# EAGLE design open-lux-E-add-VBUS (EAGLE 6.5.0)
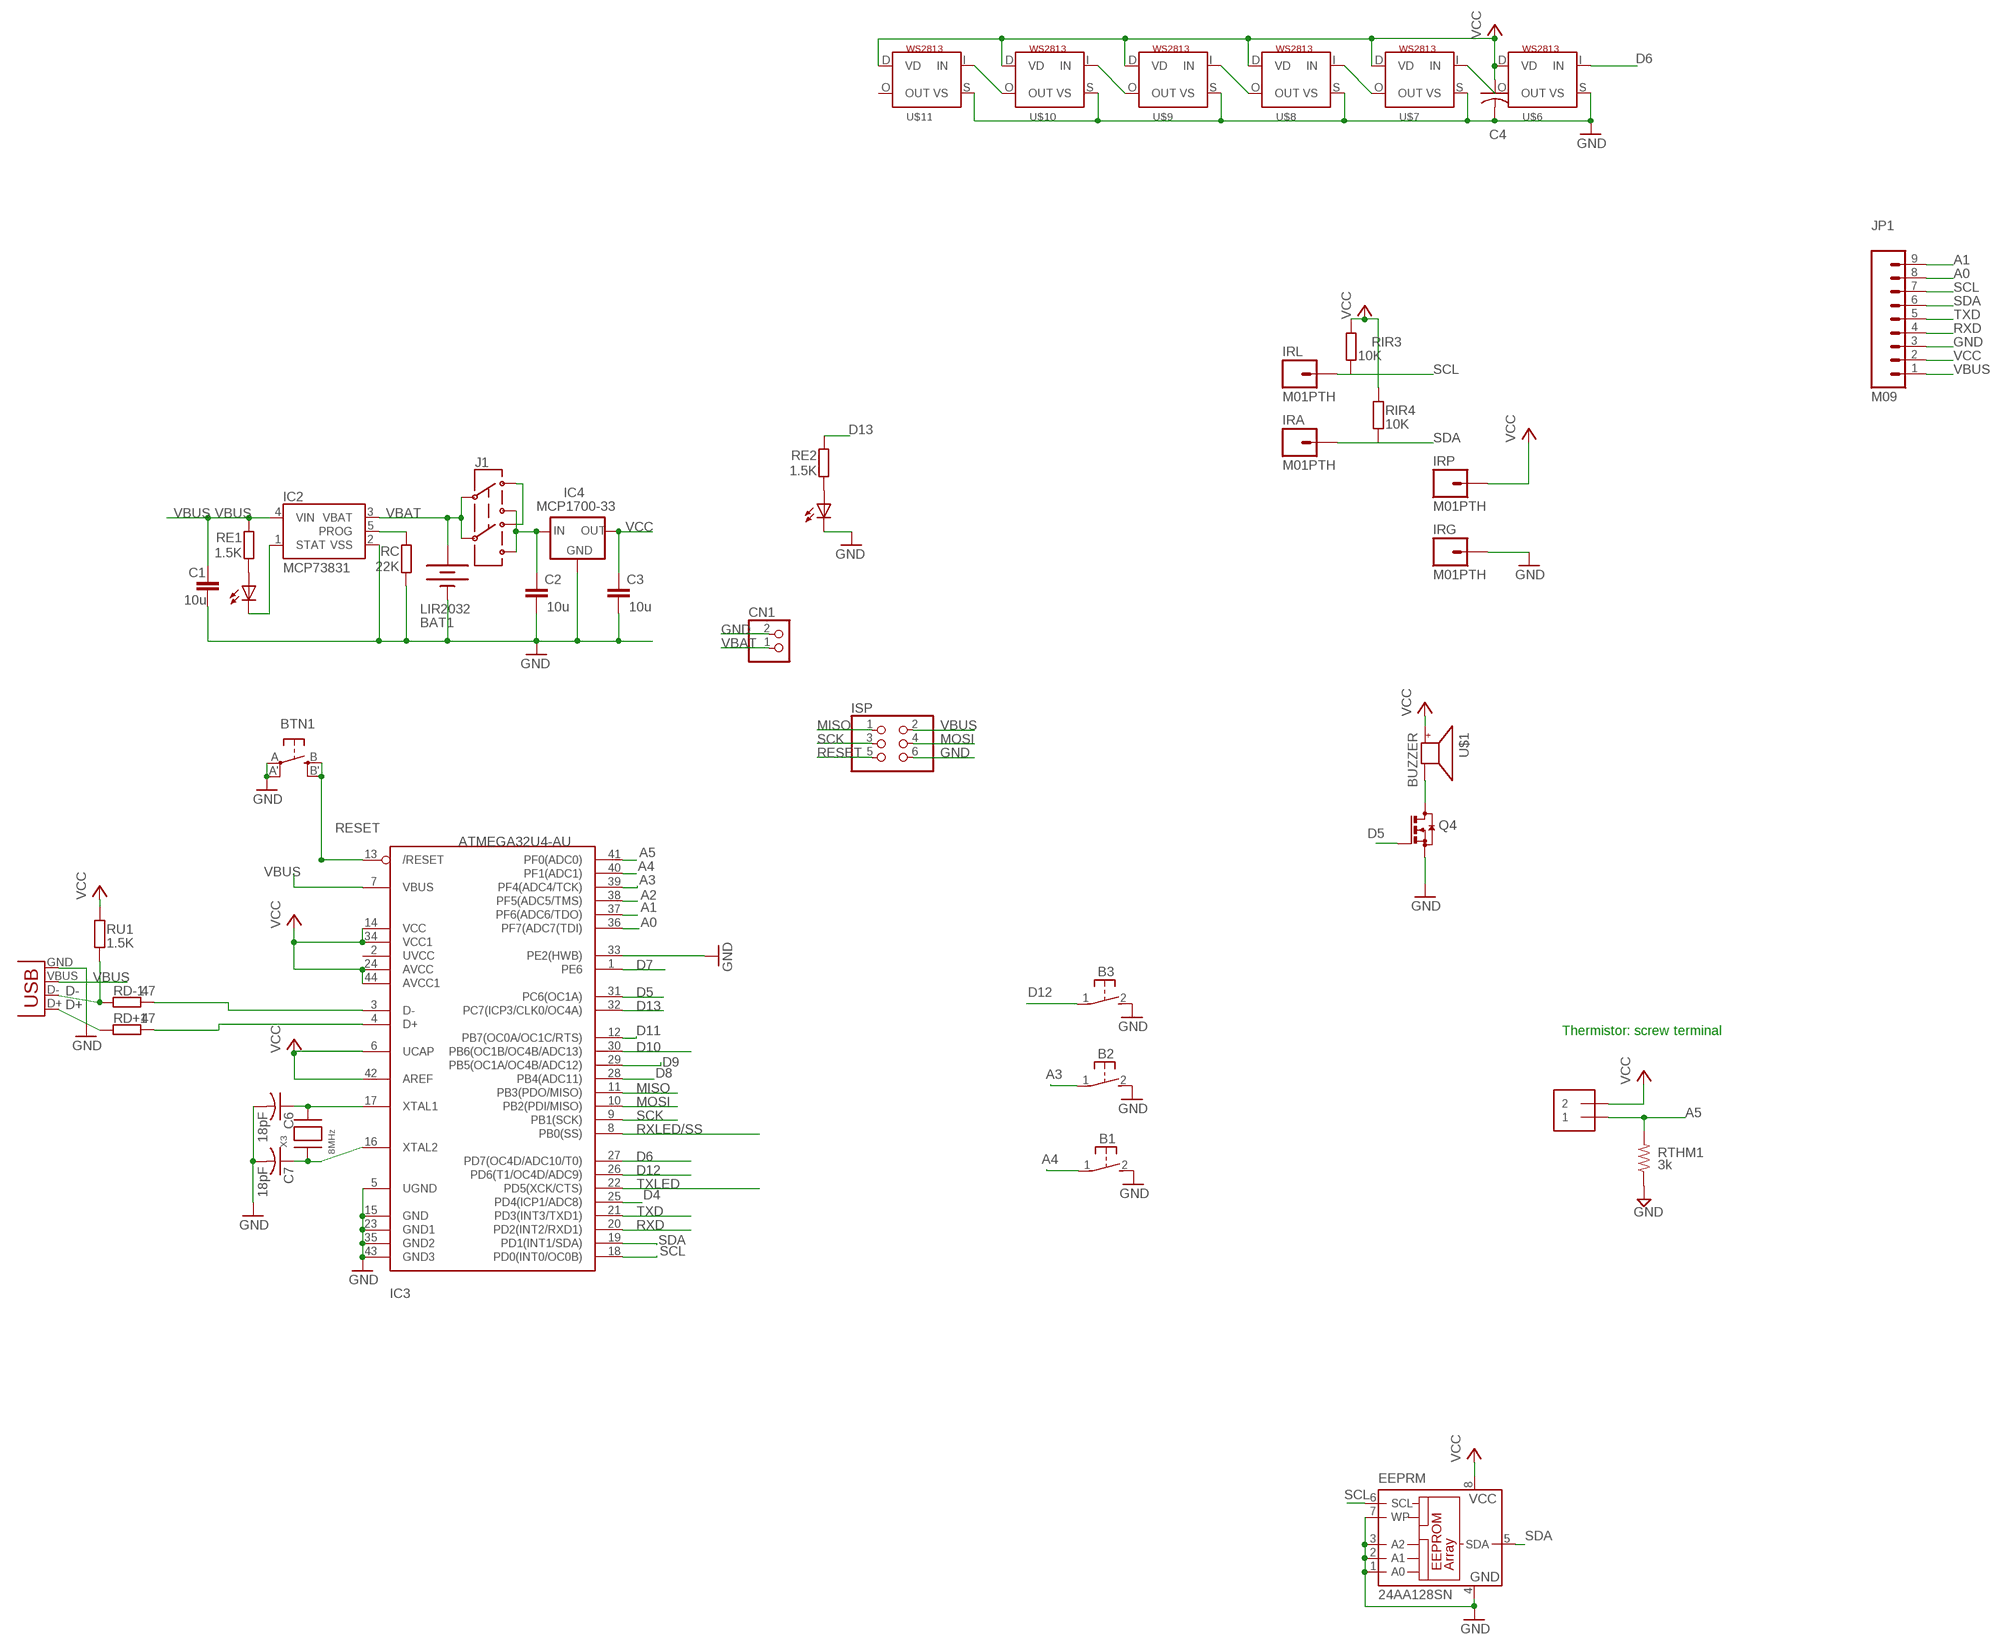
[diagram p0: schematic, sheet 1, part 1 of 2]
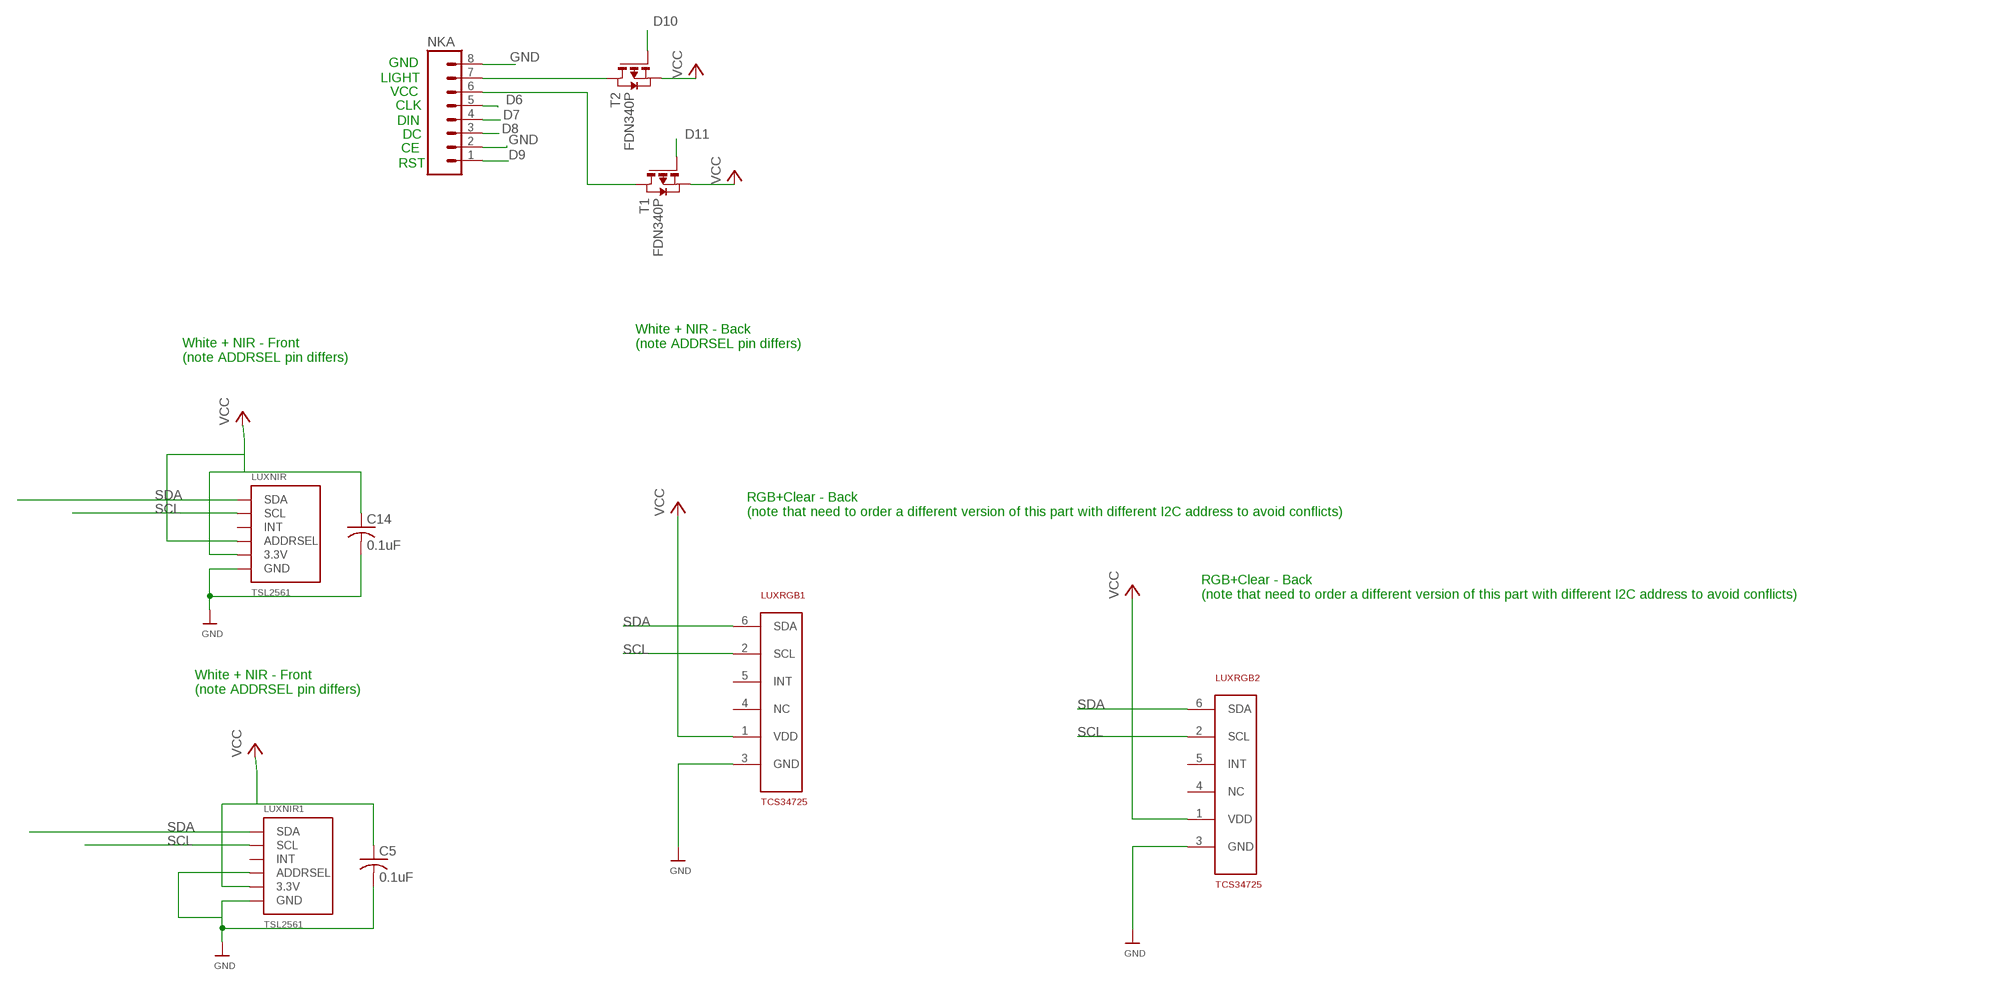
[diagram p1: schematic, sheet 1, part 2 of 2]

## Parts
B1  31-XX  [B3F-31XX]
B2  31-XX  [B3F-31XX]
B3  31-XX  [B3F-31XX]
BAT1  LIR2032  BATTERYBATTCOM_20MM_PTH_SMT  [BATTCOM_20MM_PTH_SMT]
BLNK  0805  LEDCHIPLED_0805  [CHIPLED_0805]
BTN1  EVQQ2  [EVQ-Q2]
C1  10u  C-EUC0805  [C0805]
C2  10u  C-EUC0805  [C0805]
C3  10u  C-EUC0805  [C0805]
C4  C-USC0805K  [C0805K]
C5  0.1uF  C-USC0805  [C0805]
C6  18pF  C-USC0805K  [C0805K]
C7  18pF  C-USC0805K  [C0805K]
C14  0.1uF  C-USC0805  [C0805]
CHARGE  0805  LEDCHIPLED_0805  [CHIPLED_0805]
CN1  JST_2PIN-SMT-RA  [JST-PH-2-SMT-RA]
EEPRM  24AA128SN  [SO-08]
IC2  MCP73831  [SOT23-5]
IC3  ATMEGA32U4-AU  [TQFP44]
IC4  MCP1700-33  MCP1700SOT233  [SOT23]
IRA  M01PTH  [1X01]
IRG  M01PTH  [1X01]
IRL  M01PTH  [1X01]
IRP  M01PTH  [1X01]
ISP  PINHD-2X3  [2X03]
J1  AYZ0202  [AYZ0202]
JP1  M09  [1X09]
LUXNIR  TSL2561  [TSL2561_FN@1]
LUXNIR1  TSL2561  [TSL2561_FN@1]
LUXRGB1  TCS34725  [DFN-6]
LUXRGB2  TCS34725  [DFN-6]
NKA  M08LOCK  [1X08_LOCK]
Q4  BSS123  [SOT23]
RC  22K  R-EU_R0805  [R0805]
RD+1  47  R-EU_R0805  [R0805]
RD-1  47  R-EU_R0805  [R0805]
RE1  1.5K  R-EU_R0805  [R0805]
RE2  1.5K  R-EU_R0805  [R0805]
RIR3  10K  R-EU_R0805  [R0805]
RIR4  10K  R-EU_R0805  [R0805]
RTHM1  3k  R-US_R0805  [R0805@1]
RU1  1.5K  R-EU_R0805  [R0805]
T1  FDN340P  PMOSSOT23  [SOT-23]
T2  FDN340P  PMOSSOT23  [SOT-23]
THM1  1X2-3.5MM  [1X2-3.5MM]
U$1  BUZZER  [SMT-8585-BUZZER]
U$6  WS2813  [RGBLED5050_4]
U$7  WS2813  [RGBLED5050_4]
U$8  WS2813  [RGBLED5050_4]
U$9  WS2813  [RGBLED5050_4]
U$10  WS2813  [RGBLED5050_4]
U$11  WS2813  [RGBLED5050_4]
X2  USBSMD  [USB-MINIB]
X3  8MHz  XTALNX5032  [NX5032]

## Nets
A0: IC3.36(PF7(ADC7(TDI)) JP1.8
A1: IC3.37(PF6(ADC6/TDO)) JP1.9
A2: IC3.38(PF5(ADC5/TMS))
A3: B2.1(P) IC3.39(PF4(ADC4/TCK))
A4: B1.1(P) IC3.40(PF1(ADC1))
A5: IC3.41(PF0(ADC0)) RTHM1.2 THM1.1
D4: IC3.25(PD4(ICP1/ADC8))
D5: IC3.31(PC6(OC1A)) Q4.1(G)
D6: IC3.27(PD7(OC4D/ADC10/T0)) NKA.5 U$6.I(IN)
D7: IC3.1(PE6) NKA.4
D8: IC3.28(PB4(ADC11)) NKA.3
D9: IC3.29(PB5(OC1A/OC4B/ADC12)) NKA.1
D10: IC3.30(PB6(OC1B/OC4B/ADC13)) T2.3(G)
D11: IC3.12(PB7(OC0A/OC1C/RTS)) T1.3(G)
D12: B3.1(P) IC3.26(PD6(T1/OC4D/ADC9))
D13: IC3.32(PC7(ICP3/CLK0/OC4A)) RE2.2
D+: RD+1.1 X2.D+
D-: RD-1.1 RU1.1 X2.D-
GND: B1.2(S) B2.2(S) B3.2(S) BAT1.P$1(-) BLNK.C BTN1.A'(P1) BTN1.A(P) C1.2 C2.2 C3.2 C4.2 C5.2 C6.2 C7.2 C14.2 CN1.2 EEPRM.1(A0) EEPRM.2(A1) EEPRM.3(A2) EEPRM.4(GND) EEPRM.7(WP) IC2.2(VSS) IC3.5(UGND) IC3.15(GND) IC3.23(GND1) IC3.33(PE2(HWB)) IC3.35(GND2) IC3.43(GND3) IC4.1(GND) IRG.1 ISP.6 JP1.3 LUXNIR1.ADR(ADDRSEL) LUXNIR1.VSS(GND) LUXNIR.VSS(GND) LUXRGB1.3(GND) LUXRGB2.3(GND) NKA.2 NKA.8 Q4.2(S) RC.1 RTHM1.1 U$6.S(VS) U$7.S(VS) U$8.S(VS) U$9.S(VS) U$10.S(VS) U$11.S(VS) X2.GND
MISO: IC3.11(PB3(PDO/MISO)) ISP.1
MOSI: IC3.10(PB2(PDI/MISO)) ISP.4
N$1: J1.3 J1.6
N$2: C7.1 IC3.16(XTAL2) X3.P$1
N$3: C6.1 IC3.17(XTAL1) X3.P$2
N$4: NKA.7 T2.1(D)
N$5: CHARGE.C IC2.1(STAT)
N$6: IC2.5(PROG) RC.2
N$7: Q4.3(D) U$1.-
N$8: NKA.6 T1.1(D)
N$10: CHARGE.A RE1.1
N$18: BLNK.A RE2.1
N$21: IC3.4(D+) RD+1.2
N$22: IC3.3(D-) RD-1.2
N$23: U$6.O(OUT) U$7.I(IN)
N$24: U$7.O(OUT) U$8.I(IN)
N$25: U$8.O(OUT) U$9.I(IN)
N$26: U$9.O(OUT) U$10.I(IN)
N$28: U$10.O(OUT) U$11.I(IN)
RESET: BTN1.B'(S1) BTN1.B(S) IC3.13(/RESET) ISP.5
RXD: IC3.20(PD2(INT2/RXD1)) JP1.4
RXLED/SS: IC3.8(PB0(SS))
SCK: IC3.9(PB1(SCK)) ISP.3
SCL: EEPRM.6(SCL) IC3.18(PD0(INT0/OC0B)) IRL.1 JP1.7 LUXNIR1.CLK(SCL) LUXNIR.CLK(SCL) LUXRGB1.2(SCL) LUXRGB2.2(SCL) RIR3.1
SDA: EEPRM.5(SDA) IC3.19(PD1(INT1/SDA)) IRA.1 JP1.6 LUXNIR1.DATA(SDA) LUXNIR.DATA(SDA) LUXRGB1.6(SDA) LUXRGB2.6(SDA) RIR4.1
TXD: IC3.21(PD3(INT3/TXD1)) JP1.5
TXLED: IC3.22(PD5(XCK/CTS))
VBAT: BAT1.P$2(+) CN1.1 IC2.3(VBAT) J1.2 J1.5
VBUS: C1.1 IC2.4(VIN) IC3.7(VBUS) ISP.2 JP1.1 RE1.2 X2.VBUS
VCC: C3.1 C4.1 C5.1 C14.1 EEPRM.8(VCC) IC3.6(UCAP) IC3.14(VCC) IC3.24(AVCC) IC3.34(VCC1) IC3.42(AREF) IC3.44(AVCC1) IC4.2(OUT) IRP.1 JP1.2 LUXNIR1.VDD(3.3V) LUXNIR.ADR(ADDRSEL) LUXNIR.VDD(3.3V) LUXRGB1.1(VDD) LUXRGB2.1(VDD) RIR3.2 RIR4.2 RU1.2 T1.2(S) T2.2(S) THM1.2 U$1.+ U$6.D(VD) U$7.D(VD) U$8.D(VD) U$9.D(VD) U$10.D(VD) U$11.D(VD)
VDD: C2.1 IC4.3(IN) J1.1 J1.4
Unconnected: IC3.2(UVCC) LUXNIR1.INT LUXNIR.INT LUXRGB1.4(NC) LUXRGB1.5(INT) LUXRGB2.4(NC) LUXRGB2.5(INT) U$11.O(OUT)

## Notes on the sheet
- GND
- LIGHT
- VCC
- CLK
- DIN
- DC
- CE
- RST
- White + NIR - Back
  (note ADDRSEL pin differs)
- White + NIR - Front
  (note ADDRSEL pin differs)
- RGB+Clear - Back 
  (note that need to order a different version of this part with different I2C address to avoid conflicts)
- RGB+Clear - Back 
  (note that need to order a different version of this part with different I2C address to avoid conflicts)
- White + NIR - Front
  (note ADDRSEL pin differs)
- Thermistor: screw terminal

## Library data of the parts
B1-B3 = adafruit:31-XX: OMRON SWITCH Now with beefier pads!
BAT1 = SparkFunNew:BATTERY: Battery Holders Various common sizes : AA, AAA, 20mm coin cell and 12mm coin cell.
BLNK CHARGE = led:LED: LED OSRAM: - CHIPLED LG R971, LG N971, LY N971, LG Q971, LY Q971, LO R971, LY R971 LH N974, LH R974 LS Q976, LO Q976, LY Q976 LO Q996 - Hyper CHIPLED LW Q18S LB Q993, LB Q99A, LB R99A - SideLED LS A670, LO A670, LY A670, LG A670, LP A670 LB A673, LV A673, LT A673, LW A673 LH A674 LY A675 LS A676, LA A676, LO A676, LY A676, LW A676 LS A679, LY A679, LG A679 - Hyper Micro SIDELED® LS Y876, LA Y876, LO Y876, LY Y876 LT Y87S - SmartLED LW L88C, LW L88S LB L89C, LB L89S, LG L890 LS L89K, LO L89K, LY L89K LS L896, LA L896, LO L896, LY L896 - TOPLED LS T670, LO T670, LY T670, LG T670, LP T670 LSG T670, LSP T670, LSY T670, LOP T670, LYG T670 LG T671, LOG T671, LSG T671 LB T673, LV T673, LT T673, LW T673 LH T674 LS T676, LA T676, LO T676, LY T676, LB T676, LH T676, LSB T676, LW T676 LB T67C, LV T67C, LT T67C, LS T67K, LO T67K, LY T67K, LW E67C LS E67B, LA E67B, LO E67B, LY E67B, LB E67C, LV E67C, LT E67C LW T67C LS T679, LY T679, LG T679 LS T770, LO T770, LY T770, LG T770, LP T770 LB T773, LV T773, LT T773, LW T773 LH T774 LS E675, LA E675, LY E675, LS T675 LS T776, LA T776, LO T776, LY T776, LB T776 LHGB T686 LT T68C, LB T68C - Hyper Mini TOPLED® LB M676 - Mini TOPLED Santana® LG M470 LS M47K, LO M47K, LY M47K Source: http://www.osram.convergy.de LUXEON: - LUMILED® LXK2-PW12-R00, LXK2-PW12-S00, LXK2-PW14-U00, LXK2-PW14-V00 LXK2-PM12-R00, LXK2-PM12-S00, LXK2-PM14-U00 LXK2-PE12-Q00, LXK2-PE12-R00, LXK2-PE12-S00, LXK2-PE14-T00, LXK2-PE14-U00 LXK2-PB12-K00, LXK2-PB12-L00, LXK2-PB12-M00, LXK2-PB14-N00, LXK2-PB14-P00, LXK2-PB14-Q00 LXK2-PR12-L00, LXK2-PR12-M00, LXK2-PR14-Q00, LXK2-PR14-R00 LXK2-PD12-Q00, LXK2-PD12-R00, LXK2-PD12-S00 LXK2-PH12-R00, LXK2-PH12-S00 LXK2-PL12-P00, LXK2-PL12-Q00, LXK2-PL12-R00 Source: www.luxeon.com KINGBRIGHT: KA-3528ASYC Source: www.kingbright.com
BTN1 = adafruit:EVQQ2: SMT 6mm switch, EVQQ2 series http://www.ladyada.net/library/eagle
C1-C3 = resistor:C-EU: CAPACITOR, European symbol
C4 = adafruit2013:C-US: CAPACITOR, American symbol
C5-C7 C14 = adafruit:C-US: CAPACITOR, American symbol
CN1 = adafruit:JST_2PIN: JST 2-Pin Connectors of various flavors SMT-RA (S2B-PH-SM4) 4UConnector #17311 SMT (B2B-PH-SM4) THM-RA (S2B-PH) THM (B2B-PH)
EEPRM = microchip:24*: Serial EEPROM I2C; MF: MICROCHIP; MPN: 24AA128-I/SN; OC_FARNELL: unknown; OC_NEWARK: 92C6842
IC2 = SparkFunNew:MCP73831: Microchip's MCP73831 Miniature single cell, fully integrated Li-Ion, Li-polymer charge management controller http://ww1.microchip.com/downloads/en/DeviceDoc/21984a.pdf
IC3 = adaprog:ATMEGA32U4
IC4 = adafruit:MCP1700: VOLTAGE REGULATOR
IRA IRG IRL IRP = SparkFun-Connectors:M01: Header 1 Standard 1-pin 0.1" header. Use with straight break away headers (SKU : PRT-00116), right angle break away headers (PRT-00553), swiss pins (PRT-00743), machine pins (PRT-00117), and female headers (PRT-00115).
ISP = pinhead:PINHD-2X3: PIN HEADER
J1 = SparkFunNew:AYZ0202: SPDT Slide Switch Simple SMD single-pull double-throw slide switch. Good for less than 350mA power switch, switching UARTs between devices, etc. Spark Fun Electronics SKU : COM-00597
JP1 = SparkFun-Connectors:M09: Header 9 Standard 9-pin 0.1" header. Use with straight break away headers (SKU : PRT-00116), right angle break away headers (PRT-00553), swiss pins (PRT-00743), machine pins (PRT-00117), and female headers (PRT-00115).
LUXNIR LUXNIR1 = microbuilder:TSL2561: TSL2561 Light-To-Digital Sensor Mouser Part Numbers: CS (obsolete): 856-TSL2561CS DFN (cheapest): 856-TSL2561FN
LUXRGB1 LUXRGB2 = dwbLibrary:TCS34725
NKA = SparkFun-Connectors:M08: Header 8 Standard 8-pin 0.1" header. Use with straight break away headers (SKU : PRT-00116), right angle break away headers (PRT-00553), swiss pins (PRT-00743), machine pins (PRT-00117), and female headers (PRT-00115).
Q4 = transistor-small-signal:BSS123: N-CHANNEL MOS FET
RC RD+1 RD-1 RE1 RE2 RIR3 RIR4 RU1 = rcl:R-EU_: RESISTOR, European symbol
RTHM1 = rcl:R-US_: RESISTOR, American symbol
T1 T2 = zetex:PMOSSOT23: MOS FET
THM1 = adafruit:1X2: 3.5mm Terminal block http://www.ladyada.net/library/pcb/eaglelibrary.html
U$1 = adafruit:BUZZER
U$6-U$11 = adafruit:WS2813
X2 = SparkFun:USB: USB Connectors USB-B-PTH is fully proven SKU : PRT-00139 USB-miniB is fully proven SKU : PRT-00587 USB-A-PCB is untested. USB-A-H is throughly reviewed, but untested. Spark Fun Electronics SKU : PRT-00437 USB-B-SMT is throughly reviewed, but untested. Needs silkscreen touching up. USB-A-S has not been used/tested USB-MB-H has not been used/tested
X3 = adaprog:XTAL

## Net classes
0 default: width 0.254 mm, clearance 0.203 mm
1 power: width 0.254 mm, clearance 0.203 mm

## Board
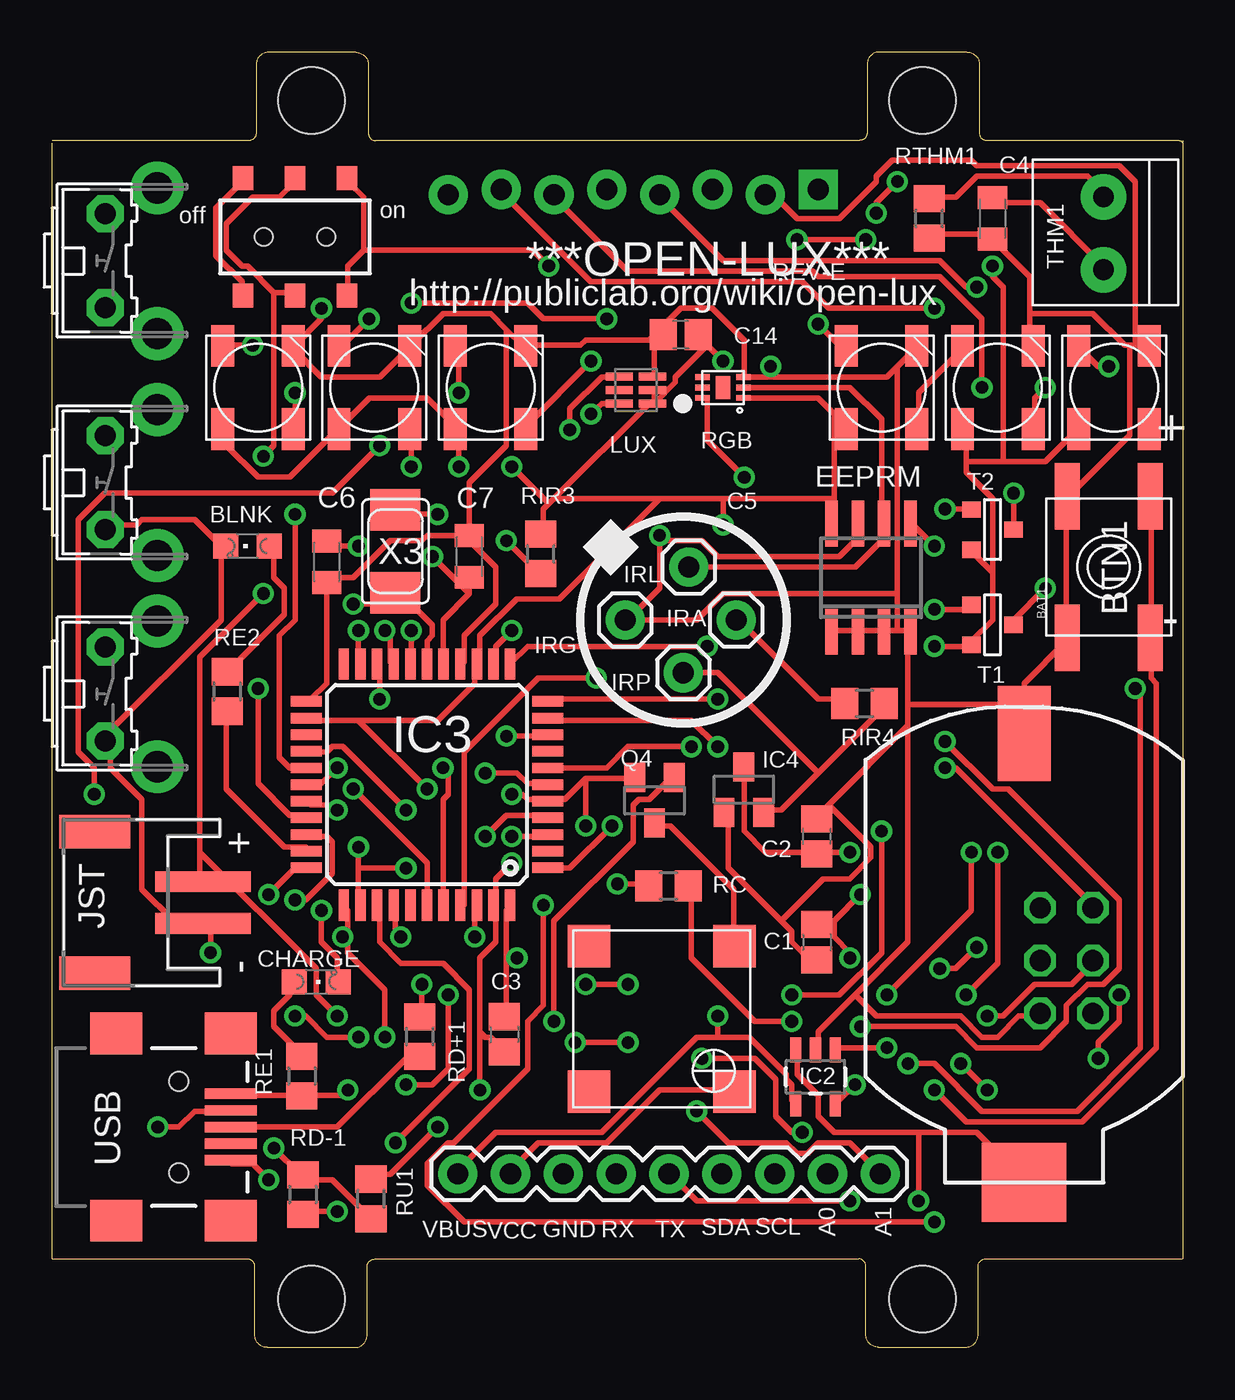
[diagram p2: board, top side]
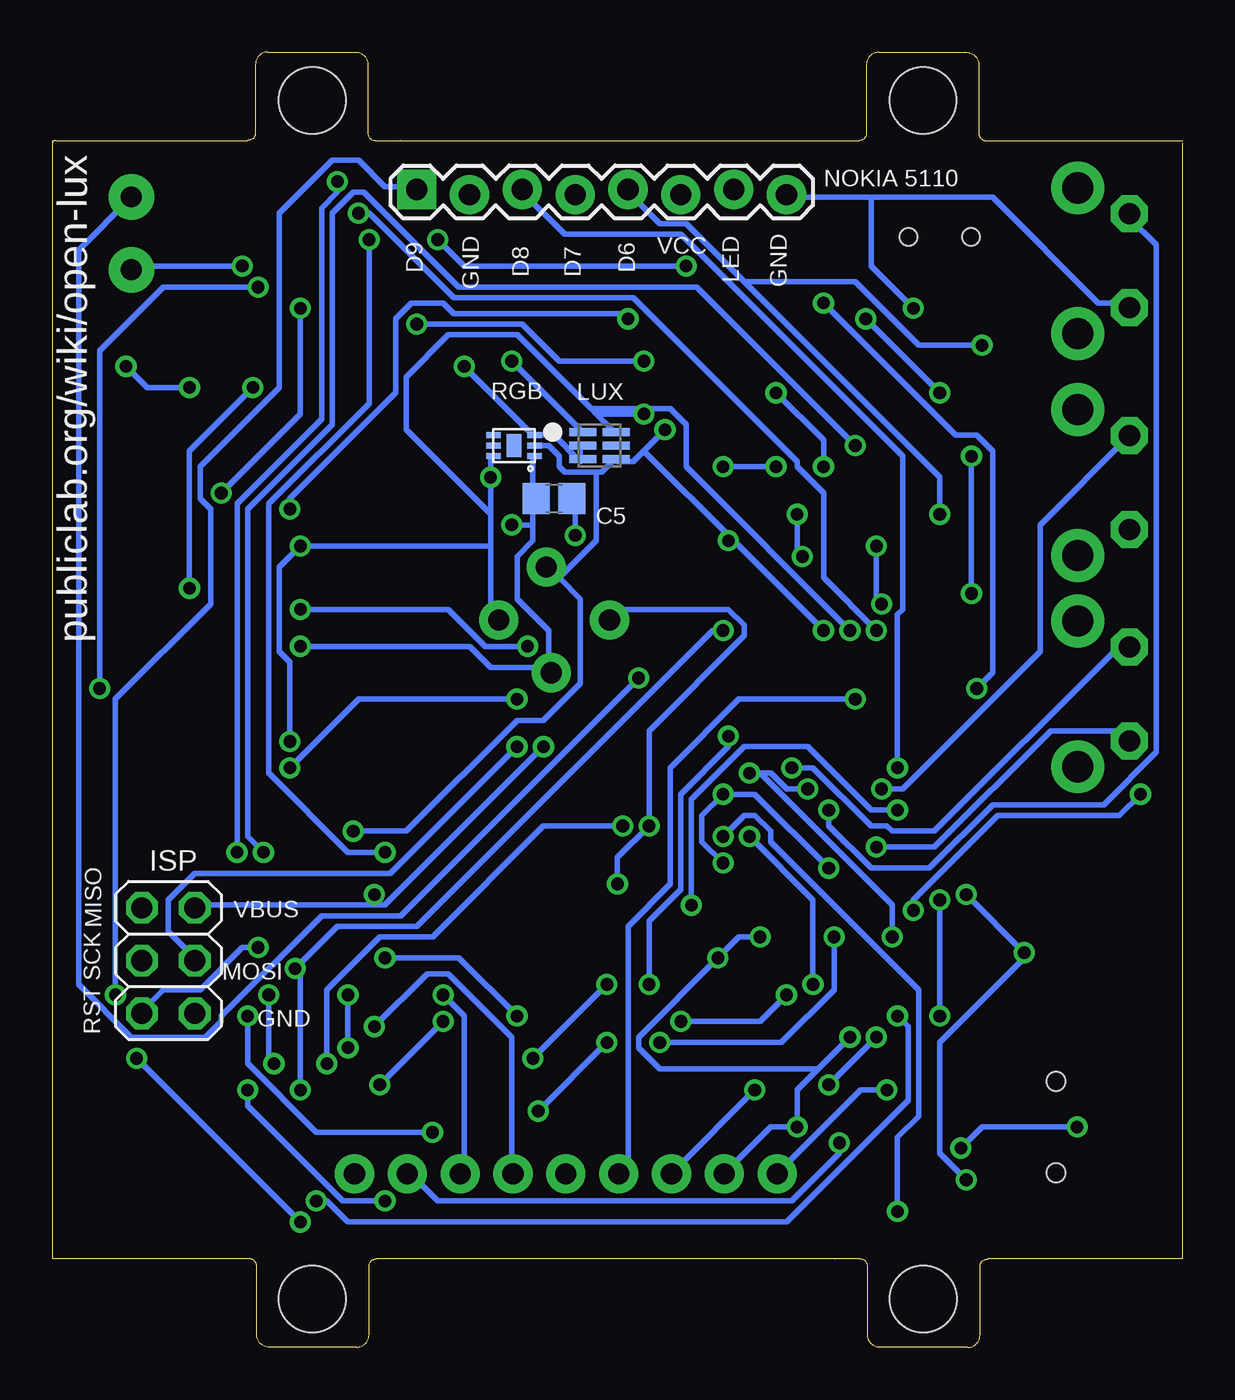
[diagram p3: board, bottom side, seen from below]

Size 54.36 x 62.3 mm. Coordinates in mm from the lower left corner, seen from the top.
Outline: 54.36,57.85 54.36,4.25
Outline: 0,4.25 0,4.27
Outline: 0,4.27 0,57.91
Outline: 38.77,4.26 arc-90 39.12,3.92 39.12,0.61 arc90 39.72,0.01 43.92,0.01 arc90 44.52,0.61 44.52,3.92 arc-90 44.87,4.26 54.33,4.26
Outline: 15.5,4.25 arc90 15.15,3.9 15.15,0.6 arc-90 14.55,0 10.35,0 arc-90 9.75,0.6 9.75,3.9 arc90 9.4,4.25
Outline: 9.39,4.25 arc90 9.37,4.26 0.01,4.26 arc-90 0,4.27
Outline: 15.51,4.26 16.72,4.26
Outline: 16.72,4.26 arc-90 16.73,4.25 16.73,4.25
Outline: 16.72,4.26 38.79,4.26
Outline: 54.36,58.04 54.36,57.87 arc90 54.19,58.04 44.96,58.04 arc-90 44.94,58.05
Outline: 15.56,58.04 arc-90 15.21,58.39 15.21,61.69 arc90 14.61,62.29 10.41,62.29 arc90 9.81,61.69 9.81,58.39 arc-90 9.46,58.04 0,58.04
Outline: 38.83,58.05 arc90 39.18,58.4 39.18,61.7 arc-90 39.78,62.3 43.98,62.3 arc-90 44.58,61.7 44.58,58.4 arc90 44.93,58.05
Outline: 38.82,58.04 37.61,58.04
Outline: 37.61,58.04 arc-90 37.6,58.05 37.6,58.05
Outline: 37.61,58.04 15.54,58.04
Copper layers (1*16): Top 0.035mm / dielectric 1.5mm / Bottom 0.035mm
Design rules "default": minimum track width 10mil, minimum drill 24mil, track to track 8mil, track to pad 8mil, pad to pad 8mil, via to via 8mil, smd to smd 8mil, copper to edge 40mil, drill to drill 8mil, minimum pad ring 10mil, minimum via ring 8mil, stop-mask expansion 4mil, vias tented up to drill 0mil, thermal gap 10mil
Holes 3.2 mm at 41.85,2.34 12.48,2.32 12.48,59.96 41.85,59.98

### Footprints (pad centres in the part's own frame; a part is rotated, then mirrored left to right if it is on the bottom)
B3F-31XX = drill 1.016 pad 1.778 octagon: 1 -2.261,-1.245; 2 2.261,-1.245 | drill 1.499 pad 2.54: 3 -3.505,1.245; 4 3.505,1.245
BATTCOM_20MM_PTH_SMT = smd 4.572 x 2.54: P$1 0,0 | smd 3.81 x 4.064: P$2 21.59,0
CHIPLED_0805 = smd 1.2 x 1.2: A 0,-1.05; C 0,1.05
EVQ-Q2 = smd 3.2 x 1.2: A -3.4,-2; A' 3.4,-2; B -3.4,2; B' 3.4,2
C0805 = smd 1.3 x 1.5: 1 -0.85,0; 2 0.85,0
C0805K = smd 1.1 x 1.4: 1 -1,0; 2 1,0
JST-PH-2-SMT-RA = smd 1 x 4.6: 1 1,-3.7; 2 -1,-3.7 | smd 1.6 x 3.4: NC1 -3.4,1.5; NC2 3.4,1.5
SO-08 = smd 0.6 x 2.2: 1 -1.905,-2.6; 2 -0.635,-2.6; 3 0.635,-2.6; 4 1.905,-2.6; 5 1.905,2.6; 6 0.635,2.6; 7 -0.635,2.6; 8 -1.905,2.6
SOT23-5 = smd 0.55 x 1.2: 1 -0.95,-1.3; 2 0,-1.3; 3 0.95,-1.3; 4 0.95,1.3; 5 -0.95,1.3
TQFP44 = smd 1.5 x 0.5: 1 -5.8,4; 2 -5.8,3.2; 3 -5.8,2.4; 4 -5.8,1.6; 5 -5.8,0.8; 6 -5.8,0; 7 -5.8,-0.8; 8 -5.8,-1.6; 9 -5.8,-2.4; 10 -5.8,-3.2; 11 -5.8,-4; 23 5.8,-4; 24 5.8,-3.2; 25 5.8,-2.4; 26 5.8,-1.6; 27 5.8,-0.8; 28 5.8,0; 29 5.8,0.8; 30 5.8,1.6; 31 5.8,2.4; 32 5.8,3.2; 33 5.8,4 | smd 0.5 x 1.5: 12 -4,-5.8; 13 -3.2,-5.8; 14 -2.4,-5.8; 15 -1.6,-5.8; 16 -0.8,-5.8; 17 0,-5.8; 18 0.8,-5.8; 19 1.6,-5.8; 20 2.4,-5.8; 21 3.2,-5.8; 22 4,-5.8; 34 4,5.8; 35 3.2,5.8; 36 2.4,5.8; 37 1.6,5.8; 38 0.8,5.8; 39 0,5.8; 40 -0.8,5.8; 41 -1.6,5.8; 42 -2.4,5.8; 43 -3.2,5.8; 44 -4,5.8
SOT23 = smd 1 x 1.4: 1 -0.95,-1.1; 2 0.95,-1.1; 3 0,1.1
1X01 = drill 1.016 pad 1.88: 1 0,0
2X03 = drill 1.016 octagon: 1 -2.54,-1.27; 2 -2.54,1.27; 3 0,-1.27; 4 0,1.27; 5 2.54,-1.27; 6 2.54,1.27
AYZ0202 = smd 1 x 1.15: 1 -2.5,2.825; 2 0,2.825; 3 2.5,2.825; 4 -2.5,-2.825; 5 0,-2.825; 6 2.5,-2.825 | hole 0.85: 1.5,0; -1.5,0
1X09 = drill 1.016 pad 1.88: 1 0,0; 2 2.54,0; 3 5.08,0; 4 7.62,0; 5 10.16,0; 6 12.7,0; 7 15.24,0; 8 17.78,0; 9 20.32,0
TSL2561_FN@1 = smd 1.3 x 0.4: ADR -0.8,0; CLK 0.8,-0.65; DATA 0.8,0.65; INT 0.8,0; VDD -0.8,0.65; VSS -0.8,-0.65
DFN-6 = smd 0.28 x 0.7: 1 -0.5,-0.988; 2 0,-0.988; 3 0.5,-0.988; 4 0.5,0.988; 5 0,0.988; 6 -0.5,0.988 | smd 1.1 x 0.7: P$1 0,0
1X08_LOCK = drill 1.016 pad 1.88 square: 1 0,0.127 | drill 1.016 pad 1.88: 2 2.54,-0.127; 3 5.08,0.127; 4 7.62,-0.127; 5 10.16,0.127; 6 12.7,-0.127; 7 15.24,0.127; 8 17.78,-0.127
R0805 = smd 1.3 x 1.5: 1 -0.95,0; 2 0.95,0
R0805@1 = smd 1.3 x 1.5: 1 -0.95,0; 2 0.95,0
SOT-23 = smd 0.787 x 0.889: 1 0.025,-1.016; 2 -0.94,1.016; 3 0.991,1.016
1X2-3.5MM = drill 1 pad 2.184: 1 1.8,0; 2 -1.7,0
SMT-8585-BUZZER = smd 2.05 x 2.05: + -3.5,-3.5; - 3.5,-3.5; NC1 -3.5,3.5; NC2 3.5,3.5
RGBLED5050_4 = smd 2 x 1.1: D -2,1.7; I 2,1.7; O -2,-1.7; S 2,-1.7
USB-MINIB = smd 2.5 x 0.5: D+ 2.5,0; D- 2.5,0.8; GND 2.5,-1.6; ID 2.5,-0.8; VBUS 2.5,1.6 | smd 2.5 x 2: GND@1 -3,-4.5; GND@2 -3,4.5; GND@3 2.5,4.5; GND@4 2.5,-4.5 | hole 0.9: 0,2.2; 0,-2.2
NX5032 = smd 2 x 2.4: P$1 2,0; P$2 -2,0

### Placement (x,y rotation side)
B1  3.81,31.43 270 top
B2  3.81,41.59 270 top
B3  3.81,52.26 270 top
BAT1  46.74,29.53 270 top
BLNK  9.4,38.55 90 top
BTN1  50.8,37.53 270 top
C1  36.77,19.5 270 top
C2  36.77,24.57 90 top
C3  21.74,15.06 270 top
C4  45.21,54.29 270 top
C5  30.23,40.83 0 bottom
C6  13.21,37.78 270 top
C7  20.07,38.04 90 top
C14  30.23,48.71 180 top
CHARGE  12.7,17.59 270 top
CN1  3.56,21.4 90 top
EEPRM  39.37,37.02 0 top
IC2  36.7,13.02 180 top
IC3  18.03,27.07 180 top
IC4  33.26,26.83 0 top
IRA  32.89,34.99 0 top
IRG  27.56,34.99 0 top
IRL  30.61,37.53 0 top
IRP  30.35,32.45 0 top
ISP  48.77,18.61 270 bottom
J1  11.68,53.4 180 top
JP1  19.5,8.36 0 top
LUXNIR  28.07,46.04 180 top
LUXNIR1  28.04,43.37 0 bottom
LUXRGB1  32.26,46.16 90 top
LUXRGB2  32.16,43.37 90 bottom
NKA  36.83,55.56 0 bottom
Q4  28.97,26.32 180 top
RC  29.64,22.2 0 top
RD+1  17.68,14.95 90 top
RD-1  12.06,7.36 270 top
RE1  12.01,13.05 270 top
RE2  8.42,31.55 270 top
RIR3  23.5,38.16 90 top
RIR4  39.06,30.97 0 top
RTHM1  42.16,54.29 90 top
RU1  15.33,7.15 90 top
T1  45.21,34.73 90 top
T2  45.21,39.31 90 top
THM1  50.55,53.53 90 top
U$1  29.31,15.8 90 top
U$6  9.91,46.16 90 top
U$7  15.49,46.16 90 top
U$8  21.08,46.16 90 top
U$9  39.88,46.16 90 top
U$10  45.47,46.16 90 top
U$11  51.05,46.16 90 top
X2  6.1,10.61 0 top
X3  16.51,38.29 90 top

### Tracks (layer width: path | path; a pad name or v marks a point on that pad's centre or on a via)
A0  (via drill 0.61)
  Top 0.254: v16.51,9.84 20.07,13.4 20.07,17.21 18.8,18.48 16.76,18.48 15.75,19.5 15.75,21.02 IC3.36
  Bottom 0.254: v16.51,9.84 16.51,9.34 18.8,7.05 35.81,7.05 37.08,8.32 JP1.8
A1  (via drill 0.61)
  Top 0.254: v16.76,19.75 16.51,20 16.51,21.02 IC3.37 | v27.69,14.67 v25.15,14.67 | v30.99,11.37 32.51,9.84 35.31,9.84 35.81,9.34 36.32,9.34 36.83,9.84 38.35,9.84 39.62,8.57 JP1.9
  Bottom 0.254: v16.76,19.75 16.76,17.21 19.3,14.67 v25.15,14.67 | v30.99,11.37 v27.69,14.67
A3  (via drill 0.61)
  Top 0.254: v14.48,26.86 18.03,23.3 IC3.39
  Bottom 0.254: v14.48,26.86 13.46,26.86 6.86,33.47 6.86,39.56 B2.1
A4  (via drill 0.61)
  Top 0.254: v18.8,27.88 19.05,27.62 19.05,26.61 18.8,26.35 18.8,21.27 IC3.40
  Bottom 0.254: v18.8,27.88 17.78,27.88 14.99,25.08 14.22,25.08 13.97,24.83 11.94,24.83 3.3,33.47 2.79,33.47 B1.1
A5  (via drill 0.61)
  Top 0.254: v26.16,32.2 23.37,32.2 19.81,28.64 19.81,21.27 IC3.41 | RTHM1.2 42.16,55.31 43.43,55.31 44.45,56.33 49.78,56.33 50.55,55.56 THM1.1
  Bottom 0.254: v26.16,32.2 37.59,20.77 41.4,20.77 46.23,15.94 46.23,15.68 46.99,14.92 50.55,14.92 53.09,17.46 53.09,52.77 50.55,55.31 THM1.1
D5  (via drill 0.61)
  Top 0.254: v24.13,15.68 24.13,20.51 27.94,24.32 27.94,26.1 28.19,26.35 28.7,26.35 29.72,27.37 Q4.1 | v19.05,16.95 19.05,13.4 18.29,12.64 v17.02,12.64 | v14.73,14.92 13.21,14.92 12.19,15.94 v11.68,15.94 | v11.68,21.53 12.19,21.53 13.46,22.8 13.46,24.32 13.21,24.57 12.45,24.57 IC3.31
  Bottom 0.254: v24.13,15.68 20.32,15.68 v19.05,16.95 | v14.73,14.92 v17.02,12.64 | v11.68,21.53 v11.68,15.94
D6  (via drill 0.61)
  Top 0.254: v11.68,40.07 11.68,34.99 10.92,34.23 10.92,28.38 11.43,27.88 12.19,27.88 IC3.27 | v9.65,48.2 8.38,48.2 U$6.I
  Bottom 0.254: v11.68,40.07 11.68,41.85 21.08,51.25 | 21.08,51.25 23.88,54.04 25.15,54.04 26.67,55.56 NKA.5 | v9.65,48.2 12.7,48.2 15.75,51.25 21.08,51.25
D7  (via drill 0.61)
  Top 0.254: v26.92,25.08 24.89,23.05 23.88,23.05 IC3.1 | v41.15,13.65 42.42,13.65 44.7,11.37 49.28,11.37 52.32,14.41 52.32,31.43 v52.07,31.69 | v44.45,50.99 43.94,50.99 42.67,52.26 32.26,52.26 29.21,55.31 NKA.4
  Bottom 0.254: v26.92,25.08 30.73,25.08 36.07,19.75 38.61,19.75 41.15,17.21 v41.15,13.65 | v52.07,31.69 52.07,47.94 49.02,50.99 v44.45,50.99
D8  (via drill 0.61)
  Top 0.254: v13.72,27.88 12.95,27.11 12.45,27.11 IC3.28
  Bottom 0.254: v13.72,27.88 13.72,35.24 13.46,35.5 13.46,42.86 24.13,53.53 29.72,53.53 31.75,55.56 NKA.3
D9  (via drill 0.61)
  Top 0.254: v13.72,25.84 13.46,26.1 12.45,26.1 IC3.29 | v23.62,21.27 23.62,16.45 22.86,15.68 22.86,13.4 19.3,9.84 19.05,9.84 18.03,8.83 18.03,7.81 19.81,6.03 v42.42,6.03 | v50.29,13.91 50.29,14.67 51.31,15.68 v51.31,16.95
  Bottom 0.254: v13.72,25.84 14.99,25.84 18.03,28.89 21.08,28.89 23.62,26.35 v23.62,21.27 | v50.29,13.91 v42.42,6.03 | v51.31,16.95 51.31,31.18 46.74,35.75 46.74,40.32 47.24,40.83 47.24,42.36 43.43,46.16 43.43,54.55 40.89,57.09 39.62,57.09 38.35,55.82 36.83,55.82 NKA.1
D10  (via drill 0.61)
  Top 0.254: v42.93,40.32 44.2,40.32 T2.3 | v26.67,49.47 23.62,49.47 22.86,50.23 v17.27,50.23 | v9.91,31.69 9.91,27.11 11.43,25.59 12.19,25.59 IC3.30
  Bottom 0.254: v42.93,40.32 42.93,40.83 37.85,45.91 37.85,49.47 37.08,50.23 35.56,50.23 35.05,49.72 26.92,49.72 v26.67,49.47 | v17.27,50.23 10.92,43.88 9.91,43.88 9.14,43.12 9.14,32.45 v9.91,31.69
D11  (via drill 0.61)
  Top 0.254: v42.42,35.5 44.2,35.5 T1.3 | v31.5,33.72 22.86,33.72 22.1,32.96 IC3.12
  Bottom 0.254: v42.42,35.5 35.31,35.5 33.53,33.72 v31.5,33.72
D12  (via drill 0.61)
  Top 0.254: v17.02,25.84 13.97,28.89 13.46,28.89 13.21,28.64 12.45,28.64 IC3.26
  Bottom 0.254: v17.02,25.84 17.02,25.08 14.99,23.05 12.19,23.05 9.14,26.1 3.81,26.1 1.27,28.64 1.27,53.02 2.54,54.29 B3.1
D13
  Top 0.254: IC3.32 12.19,24.07 11.18,24.07 8.38,26.86 8.38,30.42 RE2.2
D+
  Top 0.254: X2.D+ 13.72,10.61 17.02,13.91 17.53,13.91 RD+1.1
D-  (via drill 0.61)
  Top 0.254: RU1.1 15.24,6.29 13.46,8.06 12.19,8.06 RD-1.1 11.94,8.32 v10.67,9.59 | v5.08,10.61 6.1,10.61 6.86,11.37 8.38,11.37 X2.D-
  Bottom 0.254: v5.08,10.61 9.65,10.61 v10.67,9.59
GND  (via drill 0.61)
  Top 0.254: v10.41,21.78 11.68,23.05 12.19,23.05 IC3.33 | v7.62,18.99 7.62,20 7.37,20.26 CN1.2 7.11,20.51 5.84,20.51 4.32,22.04 4.32,26.35 2.79,27.88 2.79,29.15 B1.2 2.54,29.4 8.13,34.99 8.13,38.55 | v10.41,8.06 9.65,8.83 8.64,8.83 X2.GND | v14.73,24.07 14.73,23.05 | 14.73,23.05 14.73,21.27 IC3.35 | 8.13,38.55 6.86,39.82 4.32,39.82 4.06,39.56 2.79,39.56 B2.2 | 8.13,38.55 BLNK.C | 20.57,15.18 20.83,14.92 21.08,14.92 21.59,14.41 C3.2 | 20.57,15.18 20.57,18.73 21.34,19.5 21.34,21.02 IC3.43 21.34,21.27 21.34,22.54 v22.1,23.3 | 20.57,15.18 v20.57,12.38 | 25.65,27.37 27.94,27.37 Q4.2 | 25.65,27.37 24.64,26.35 23.88,26.35 IC3.5 23.62,26.35 22.86,26.35 22.61,26.61 v22.1,26.61 | v27.18,22.29 28.45,22.29 RC.1 | 25.65,27.37 v25.65,25.08 | 29.21,38.8 29.21,36.51 27.69,34.99 | 29.21,38.8 31.24,38.8 32,38.04 37.85,38.04 38.61,38.8 38.61,39.56 EEPRM.7 | 29.21,38.8 v29.21,39.05 | v17.02,23.05 14.73,23.05 | RTHM1.1 42.16,53.53 45.21,53.53 C4.2 45.21,53.28 46.99,51.5 46.99,49.72 | 46.99,49.72 46.99,48.2 U$10.S | 51.82,48.2 51.56,48.2 50.04,49.72 46.99,49.72 | 51.82,48.2 52.07,48.2 | 52.07,48.2 52.58,48.2 U$11.S | 52.07,48.2 52.07,56.07 51.31,56.83 44.45,56.83 44.2,57.09 40.39,57.09 39.62,56.33 39.62,56.07 37.85,54.29 35.81,54.29 34.8,55.31 34.29,55.31 NKA.2 | 46.74,30.93 46.74,31.94 48.77,33.97 BTN1.A' 48.77,34.23 48.77,40.83 BTN1.A 49.02,41.09 51.82,43.88 51.82,48.2 | 46.74,30.93 BAT1.P$1 46.74,29.65 | 35.05,20.51 35.56,20 35.56,19.5 36.58,18.48 C1.2 | 35.05,20.51 32.51,23.05 32.51,25.59 IC4.1 | EEPRM.1 37.59,34.48 38.61,34.48 EEPRM.2 38.86,34.48 39.88,34.48 EEPRM.3 40.13,34.48 40.64,34.48
  Top 0.254: 38.61,16.95 41.15,19.5 41.15,29.91 | 38.61,16.95 36.83,15.18 36.83,14.41 IC2.2 | 41.15,30.93 41.15,34.23 EEPRM.4 | 41.15,30.93 41.15,29.91 | 41.15,29.91 37.34,26.1 | 37.34,26.1 36.83,25.59 C2.2 | 40.64,34.48 41.15,34.48 EEPRM.4 | 41.4,34.48 EEPRM.4 | 38.61,16.95 39.62,15.94 43.69,15.94 44.7,14.92 45.47,14.92 46.48,15.94 47.5,15.94 ISP.6 | 35.05,20.51 37.08,22.54 38.35,22.54 39.37,23.56 39.37,24.07 37.34,26.1 | 41.15,30.93 46.74,30.93 | 34.54,46.67 40.13,46.67 40.64,47.18 | 34.54,46.67 33.27,46.67 | 40.64,47.18 41.4,47.94 U$9.S | 34.54,46.67 v34.54,47.18 | IC3.23 12.45,31.18 13.21,31.94 C6.2 13.21,37.02 14.48,37.02 16.26,38.8 17.78,38.8 18.03,39.05 20.07,39.05 | IC3.15 19.81,32.96 19.81,34.23 21.34,35.75 21.34,37.53 20.07,38.8 C7.2 20.07,39.05 | 28.96,48.45 28.96,46.67 LUXNIR.VSS | 28.96,48.45 29.21,48.71 C14.2 28.96,48.45 | 28.96,48.45 28.7,48.45 | 28.7,48.45 25.65,48.45 25.4,48.2 22.86,48.2 U$8.S 22.61,48.2 21.84,48.96 | 21.84,48.96 21.08,49.72 18.8,49.72 17.27,48.2 U$7.S 17.02,47.94 15.75,46.67 12.95,46.67 11.68,47.94 U$6.S 11.68,48.2 12.95,49.47 v12.95,49.98 | 20.07,39.05 20.07,41.59 21.84,43.37 21.84,48.96 | 33.27,46.67 33.27,48.45 31.75,49.98 30.23,49.98 28.7,48.45 | 33.27,46.67 LUXRGB1.3 | 40.64,47.18 40.64,36.26 | 40.64,36.26 40.64,34.48 | 27.69,34.99 30.99,34.99 32.26,36.26 40.64,36.26 | 27.69,34.99 IRG.1
  Bottom 0.254: v10.41,21.78 v7.62,18.99 7.62,18.73 11.68,14.67 11.68,9.34 v10.41,8.06 | v14.73,24.07 11.94,24.07 6.35,29.65 3.05,29.65 B1.2 | v20.57,12.38 24.38,8.57 JP1.3 | v27.18,22.29 27.18,23.56 v25.65,25.08 25.65,29.65 21.08,34.23 21.08,34.73 21.84,35.5 26.92,35.5 27.43,34.99 IRG.1 | v29.21,39.05 29.21,40.83 C5.2 | v22.1,23.3 23.11,24.32 23.11,25.59 v22.1,26.61 20.57,26.61 v17.02,23.05 | 14.99,55.31 19.05,55.31 NKA.8 | 14.99,55.31 9.14,55.31 4.06,50.23 2.79,50.23 B3.2 | LUXNIR1.ADR 28.96,43.37 28.96,42.86 LUXNIR1.VSS 28.96,42.61 30.23,43.88 30.99,43.88 LUXRGB2.3 31.24,43.88 v34.54,47.18 | 14.99,55.31 14.99,52.01 v12.95,49.98
MISO  (via drill 0.61)
  Top 0.254: v32,31.18 23.88,31.18 IC3.11 | v42.93,27.88 43.43,27.88 50.04,21.27 ISP.1
  Bottom 0.254: v32,31.18 39.62,31.18 v42.93,27.88
MOSI  (via drill 0.61)
  Top 0.254: v32,28.89 30.73,30.16 23.88,30.16 IC3.10
  Bottom 0.254: v32,28.89 38.1,22.8 47.5,22.8 48.77,21.53 48.77,20 47.5,18.73 ISP.4
N$1
  Top 0.254: J1.3 9.14,50.74 9.14,51.25 7.87,52.52 7.87,54.8 9.14,56.07 J1.6
N$2  (via drill 0.61)
  Top 0.254: 20.07,36.26 C7.1 | 20.07,36.26 18.8,34.99 18.8,32.96 IC3.16 | v18.54,40.07 16.51,40.07 X3.P$1 | 20.07,36.26 v18.29,38.04
  Bottom 0.254: v18.54,40.07 18.54,38.29 v18.29,38.04
N$3  (via drill 0.61)
  Top 0.254: v14.73,38.55 13.21,38.55 C6.1 | v14.48,35.75 16,35.75 16.51,36.26 X3.P$2 16.51,36.51 18.29,34.73 18.29,34.23 18.03,33.97 18.03,32.96 IC3.17
  Bottom 0.254: v14.73,38.55 14.73,36.01 v14.48,35.75
N$4  (via drill 0.61)
  Top 0.254: v46.23,41.09 T2.1 | v42.42,49.98 37.34,49.98 36.07,51.25 25.91,51.25 21.59,55.56 NKA.7
  Bottom 0.254: v46.23,41.09 42.42,44.9 v42.42,49.98
N$5  (via drill 0.61)
  Top 0.254: v12.95,21.02 12.95,19.5 13.72,18.73 13.72,17.72 CHARGE.C | v2.03,26.61 2.03,27.88 1.27,28.64 1.27,39.82 2.54,41.09 13.46,41.09 v15.75,43.37 | v44.2,23.81 44.2,21.02 v40.13,16.95 | v40.13,14.41 37.85,14.41 IC2.1
  Bottom 0.254: v12.95,21.02 12.95,21.53 8.89,25.59 3.05,25.59 v2.03,26.61 | v15.75,43.37 23.37,50.99 34.8,50.99 39.37,55.56 39.88,55.56 40.89,54.55 40.89,44.39 44.96,40.32 44.96,24.57 v44.2,23.81 | v40.13,14.41 v40.13,16.95
N$6  (via drill 0.61)
  Top 0.254: v38.61,12.64 37.85,11.88 IC2.5 | v35.56,15.68 33.78,15.68 30.73,18.73 30.73,22.04 RC.2
  Bottom 0.254: v35.56,15.68 v38.61,12.64
N$7
  Top 0.254: Q4.3 29.21,25.08 29.72,25.08 32.77,22.04 32.77,19.5 U$1.-
N$8  (via drill 0.61)
  Top 0.254: v47.75,36.51 46.23,34.99 T1.1 | v44.7,46.16 44.7,49.47 42.67,51.5 36.83,51.5 36.58,51.75 27.69,51.75 24.13,55.31 NKA.6
  Bottom 0.254: v47.75,36.51 47.75,43.12 v44.7,46.16
N$10
  Top 0.254: CHARGE.A 11.43,17.46 11.43,16.95 10.67,16.19 10.67,15.43 11.94,14.16 RE1.1
N$18
  Top 0.254: BLNK.A 10.67,38.55 10.67,37.02 11.18,36.51 11.18,35.24 8.64,32.7 RE2.1
N$21  (via drill 0.61)
  Top 0.254: v17.78,17.46 17.78,15.94 RD+1.2 | v20.83,24.57 21.84,25.59 23.62,25.59 IC3.4
  Bottom 0.254: v17.78,17.46 17.78,21.53 v20.83,24.57
N$22  (via drill 0.61)
  Top 0.254: v13.72,6.54 12.19,6.54 RD-1.2 | v22.1,24.57 23.62,24.57 IC3.3
  Bottom 0.254: v13.72,6.54 13.72,10.1 12.7,11.11 12.7,17.21 19.81,24.32 19.81,24.83 20.57,25.59 21.08,25.59 v22.1,24.57
N$23  (via drill 0.61)
  Top 0.254: v11.68,45.91 11.68,44.39 U$6.O | v15.24,49.47 13.97,48.2 U$7.I
  Bottom 0.254: v15.24,49.47 v11.68,45.91
N$24  (via drill 0.61)
  Top 0.254: v17.27,42.36 17.27,44.13 U$7.O | v19.56,45.91 19.56,47.94 U$8.I
  Bottom 0.254: v17.27,42.36 17.27,43.62 v19.56,45.91
N$25  (via drill 0.61)
  Top 0.254: v25.91,47.44 22.86,44.39 U$8.O | v36.83,49.21 38.1,47.94 U$9.I
  Bottom 0.254: v25.91,47.44 29.97,47.44 31.75,49.21 v36.83,49.21
N$26
  Top 0.254: U$9.O 41.66,44.39 41.66,45.91 43.69,47.94 U$10.I
N$28  (via drill 0.61)
  Top 0.254: v47.75,46.16 47.24,45.66 47.24,44.39 U$10.O | v50.8,47.18 50.29,47.18 49.53,47.94 U$11.I
  Bottom 0.254: v47.75,46.16 49.78,46.16 v50.8,47.18
RESET  (via drill 0.61)
  Top 0.254: BTN1.B 52.83,40.83 52.83,34.23 BTN1.B' 52.83,33.97 52.83,32.2 53.09,31.94 53.09,14.41 49.53,10.86 43.94,10.86 v42.42,12.38 | v22.1,34.48 21.34,33.72 21.34,32.96 IC3.13 | v42.67,18.23 43.43,18.23 v44.45,19.24
  Bottom 0.254: v22.1,34.48 22.61,34.48 36.83,20.26 40.64,20.26 42.42,18.48 | v44.45,19.24 45.21,19.24 47.24,17.21 49.02,17.21 50.04,16.19 ISP.5 | 42.42,18.48 v42.42,12.38 | 42.42,18.48 v42.67,18.23
RXD  (via drill 0.61)
  Top 0.254: v15.75,31.18 15.75,32.7 IC3.20
  Bottom 0.254: v15.75,31.18 21.34,31.18 24.64,27.88 24.64,22.29 26.67,20.26 26.67,8.83 26.92,8.57 JP1.4
SCK  (via drill 0.61)
  Top 0.254: v21.84,29.4 23.62,29.4 IC3.9 | v27.69,17.46 v25.65,17.46 | v31.24,13.91 33.78,13.91 34.8,12.89 34.8,11.11 35.56,10.35 v36.07,10.35 | v44.96,15.94 45.72,15.94 47.24,17.46 49.02,17.46 50.04,18.48 ISP.3
  Bottom 0.254: v21.84,29.4 21.84,28.89 24.13,26.61 24.13,22.04 25.65,20.51 v25.65,17.46 | v31.24,13.91 v27.69,17.46 | v36.07,10.35 41.66,10.35 44.96,13.65 v44.96,15.94
SCL  (via drill 0.61)
  Top 0.254: v24.89,44.13 24.89,45.15 26.42,46.67 27.18,46.67 LUXNIR.CLK | v17.27,34.48 17.27,32.96 IC3.18 | v21.84,38.8 23.37,37.28 RIR3.1 | LUXRGB1.2 38.35,46.16 39.88,44.64 39.88,39.82 EEPRM.6 39.88,39.56 39.88,38.8 38.61,37.53 IRL.1 | v35.56,16.95 37.85,16.95 39.88,18.99 v39.88,24.83
  Bottom 0.254: LUXRGB2.2 30.48,43.37 29.97,42.86 29.97,42.36 29.72,42.1 28.19,42.1 | 28.19,42.1 27.94,42.1 27.43,42.61 LUXNIR1.CLK 27.18,42.61 26.42,42.61 25.91,43.12 | 25.91,43.12 v24.89,44.13 | 25.91,43.12 21.59,38.8 | 21.59,38.8 v17.27,34.48 | 21.59,38.8 v21.84,38.8 | v35.56,16.95 34.54,15.94 34.54,8.57 JP1.7 | v39.88,24.83 37.34,24.83 32,30.16 30.73,30.16 28.96,31.94 28.96,36.01 29.97,37.02 | 29.97,37.02 30.48,37.53 IRL.1 29.97,37.02 | 28.19,42.1 28.19,38.8 29.97,37.02
SDA  (via drill 0.61)
  Top 0.254: v33.27,41.85 31.5,43.62 31.5,45.66 LUXRGB1.6 | v25.91,44.9 26.42,45.4 27.18,45.4 LUXNIR.DATA | RIR4.1 38.1,31.18 36.83,31.18 33.02,34.99 IRA.1 | v16,34.48 16.26,34.23 16.26,32.96 IC3.19 | v42.42,38.55 41.4,39.56 EEPRM.5 | v38.86,15.43 43.43,15.43 44.45,14.41 47.5,14.41 48.77,15.68 48.77,16.45 49.78,17.46 50.55,17.46 51.31,18.23 51.31,21.53 45.97,26.86 45.21,26.86 v42.93,29.15
  Bottom 0.254: 33.27,38.55 33.27,35.24 33.02,34.99 IRA.1 | 33.27,38.55 33.27,40.07 | 33.27,40.07 v33.27,41.85 33.27,42.86 LUXRGB2.6 | 28.45,45.15 32,48.71 35.31,48.71 37.34,46.67 37.34,44.13 33.27,40.07 | 28.45,45.15 28.19,44.9 | 28.19,44.9 27.43,44.13 LUXNIR1.DATA | 28.19,44.9 v25.91,44.9 | v16,34.48 23.88,42.36 23.88,44.39 24.64,45.15 28.45,45.15 | 33.27,38.55 v42.42,38.55 43.43,37.53 43.43,33.47 42.93,32.96 v42.93,29.15 | v38.86,15.43 36.32,17.97 35.31,17.97 32.26,14.92 32.26,8.57 JP1.6
TXD  (via drill 0.61)
  Top 0.254: v14.73,34.48 14.73,32.96 IC3.21 | v39.62,54.55 39.62,55.05 v40.64,56.07 | v45.47,23.81 45.47,18.48 v43.94,16.95 | v44.96,12.38 v43.69,13.65 | v38.35,7.05 30.99,7.05 29.72,8.32 JP1.5
  Bottom 0.254: v14.73,34.48 17.27,37.02 17.27,41.09 18.54,42.36 18.54,42.61 26.42,50.48 35.05,50.48 39.12,54.55 v39.62,54.55 | v40.64,56.07 40.64,55.56 41.4,54.8 41.4,44.64 45.47,40.58 v45.47,23.81 | v43.94,16.95 43.94,13.91 v43.69,13.65 | v44.96,12.38 44.96,11.62 40.39,7.05 v38.35,7.05
VBAT  (via drill 0.61)
  Top 0.254: 41.66,10.35 44.45,10.35 46.74,8.06 BAT1.P$2 | 41.66,10.35 37.59,10.35 36.83,11.11 36.83,12.13 35.81,13.14 35.81,14.16 IC2.3 | 10.67,50.74 11.68,50.74 J1.2 | 10.67,50.74 9.4,52.01 9.14,52.01 8.38,52.77 8.38,54.04 9.65,55.31 10.92,55.31 11.68,56.07 J1.5 | 10.67,50.74 10.67,43.37 v10.16,42.86 | v10.16,36.26 7.11,33.21 7.11,23.81 | 7.11,23.81 7.11,22.54 CN1.1 | v41.66,7.05 41.66,10.35 | v13.72,15.94 12.7,16.95 12.7,18.23 7.11,23.81
  Bottom 0.254: v10.16,36.26 v10.16,42.86 | v41.66,7.05 41.15,7.05 40.13,6.03 19.05,6.03 13.21,11.88 13.21,15.43 v13.72,15.94
VBUS  (via drill 0.61)
  Top 0.254: v30.73,28.89 27.69,28.89 26.67,27.88 23.88,27.88 IC3.7 | 37.59,20.51 36.83,20.51 C1.1 | v38.86,21.78 37.59,20.51 | X2.VBUS 8.64,12.13 11.94,12.13 RE1.2 12.19,12.13 13.97,12.13 v14.22,12.38 | 32,14.92 30.99,14.92 26.42,10.35 21.34,10.35 19.56,8.57 JP1.1 | 32,14.92 33.53,14.92 35.31,13.14 35.31,12.89 35.56,12.64 35.56,11.88 IC2.4 | 37.59,20.51 37.59,19.75 38.35,18.99 v38.35,18.73 | 32,14.92 v32,15.94
  Bottom 0.254: v30.73,28.89 38.35,21.27 38.86,21.27 | 38.86,21.27 47.5,21.27 ISP.2 | 38.86,21.27 v38.86,21.78 | v14.22,12.38 15.49,12.38 19.3,8.57 JP1.1 | v38.35,18.73 34.8,18.73 v32,15.94
VCC  (via drill 0.61)
  Top 0.254: 21.84,18.73 21.84,21.02 IC3.44 | 21.84,18.73 21.84,15.94 C3.1 | v18.54,10.61 16.26,8.32 15.49,8.32 RU1.2 | 14.22,19.75 14.22,18.99 16,17.21 v16,14.92 | 14.22,19.75 14.22,21.02 IC3.34 | v20.32,19.75 20.32,21.02 IC3.42 | U$1.+ 32.77,12.38 29.21,12.38 26.67,9.84 23.37,9.84 22.1,8.57 JP1.2 | v22.35,18.73 21.84,18.73 | C4.1 45.21,55.05 47.5,55.05 50.55,52.01 THM1.2 | 45.21,37.28 45.21,34.99 44.2,33.97 T1.2 44.2,33.72 v42.42,33.72 | 45.21,37.28 44.2,38.29 T2.2 | 43.94,42.61 43.94,42.1 45.21,40.83 45.21,37.28 | 43.94,42.61 43.94,44.13 U$10.D | 43.94,42.61 45.72,42.61 | 45.72,42.61 47.75,42.61 49.28,44.13 U$11.D | v45.21,52.01 45.21,51.5 45.72,50.99 45.72,42.61 | 36.83,27.62 40.13,30.93 RIR4.2 | 36.83,27.62 35.05,25.84 34.29,25.84 IC4.2 | 36.83,27.62 32,32.45 IRP.1 | 14.73,30.16 18.54,30.16 20.32,31.94 20.32,32.7 IC3.14 20.57,32.96 20.57,34.23 22.35,36.01 24.38,36.01 29.21,40.83 | 14.73,30.16 12.45,30.16 IC3.24 | v20.83,27.62 22.35,27.62 22.86,27.11 23.62,27.11 IC3.6 | 14.73,30.16 v18.03,26.86 | U$6.D 8.38,44.13 8.38,43.37 9.91,41.85 11.43,41.85 13.72,44.13 U$7.D 13.97,44.39 15.24,45.66 18.03,45.66 19.3,44.39 U$8.D 19.56,44.13 v19.56,42.36 | 37.59,44.9 38.1,44.39 U$9.D | 37.59,44.9 36.83,45.66 33.27,45.66 LUXRGB1.1 | 37.59,44.9 37.59,40.83 | 37.59,40.83 37.59,39.82 EEPRM.8 | 31.5,48.2 30.99,48.71 C14.1 31.5,48.2 | 31.5,48.2 v32.26,47.44 | 28.96,45.4 28.96,45.91 LUXNIR.ADR | 24.13,40.83 28.7,45.4 LUXNIR.VDD 28.96,45.4 | 24.13,40.83 23.88,40.58 | 23.88,40.58 23.62,40.32 23.62,39.31 RIR3.2 | 31.5,48.2 29.97,46.67 29.97,46.42 28.96,45.4 | 24.13,40.83 29.21,40.83 | 29.21,40.83 32.26,40.83 | 32.26,40.83 37.59,40.83
  Top 0.254: 23.88,40.58 v22.1,42.36 | 32.26,40.83 v32.26,39.56 | v13.97,19.75 14.22,19.75
  Bottom 0.254: JP1.2 21.84,8.57 19.81,10.61 v18.54,10.61 18.54,12.38 17.53,13.4 | 17.53,13.4 v16,14.92 | v20.32,19.75 21.34,19.75 v22.35,18.73 26.16,14.92 26.16,14.41 25.15,13.4 17.53,13.4 | v45.21,52.01 50.55,52.01 THM1.2 | 31.24,40.83 31.24,42.86 LUXRGB2.1 | 31.24,39.56 31.24,38.8 32,38.04 32,36.01 30.48,34.48 30.48,32.7 | 31.24,39.56 31.24,40.83 | 30.48,32.7 30.48,32.45 IRP.1 30.48,32.7 | 31.24,40.83 C5.1 | 20.32,27.62 19.81,27.62 19.05,26.86 v18.03,26.86 | 20.32,27.62 v20.83,27.62 | v32.26,47.44 28.96,44.13 LUXNIR1.VDD | v22.1,42.36 v19.56,42.36 | v32.26,39.56 31.24,39.56 | v42.42,33.72 34.29,33.72 33.27,32.7 30.48,32.7 | v13.97,19.75 13.97,21.27 20.32,27.62
VDD  (via drill 0.61)
  Top 0.254: 14.99,52.77 14.22,52.01 14.22,50.74 J1.1 | 14.99,52.77 14.99,55.31 14.22,56.07 J1.4 | IC4.3 33.27,27.88 33.27,24.83 34.29,23.81 36.58,23.81 C2.1 36.83,23.81 v38.35,23.81 | 14.99,52.77 23.11,52.77 v23.88,52.01 | v39.12,53.28 v35.81,53.28
  Bottom 0.254: v23.88,52.01 34.54,52.01 v35.81,53.28 | v39.12,53.28 39.12,45.4 43.94,40.58 43.94,27.62 40.13,23.81 v38.35,23.81

### Text on the board
tPlace: off | on | ***OPEN-LUX*** | http://publiclab.org | REV-E | /wiki/open-lux | LUX | RGB | + | C5 | - | JST | USB | VCC | SCL | VBUS | GND | RX | TX | SDA | A0 | A1
bPlace: publiclab.org/wiki/open-lux | NOKIA 5110 | GND | LED | VCC | D6 | D7 | D8 | GND | D9 | LUX | RGB | VBUS | MISO | MOSI | SCK | GND | RST